# Altium project Backplane_1_8.PrjPcb
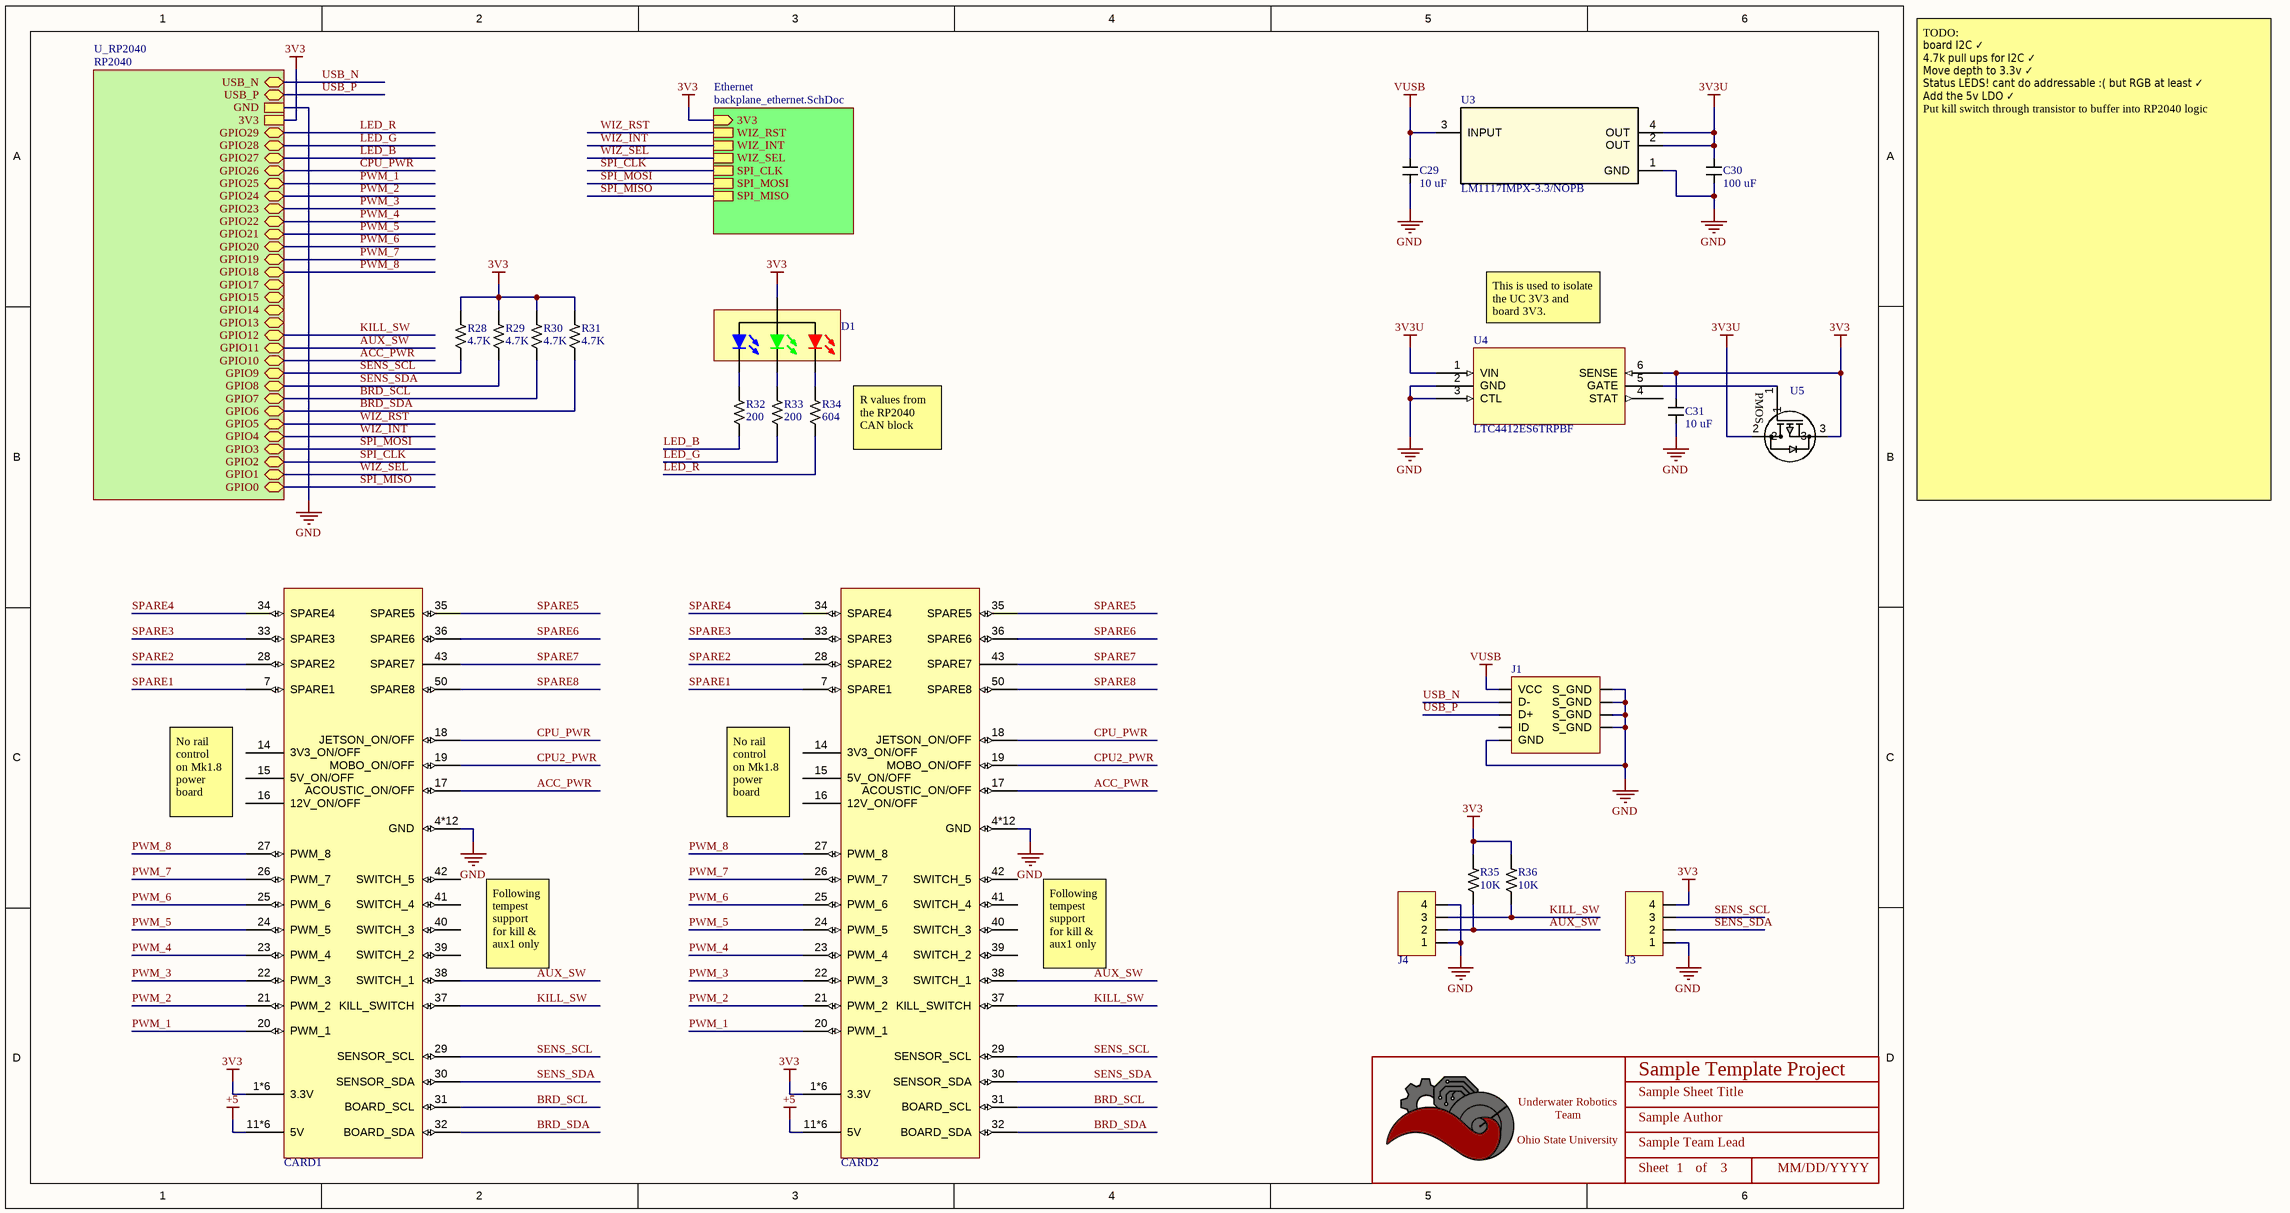
[diagram p0: backplane_main.SchDoc]
BoardRevision: 1.0; DateOfDesignReview: XX/XX/XXXX; ProjectTitle: Sample Template Project; TeamLead: Sample Team Lead
2 sheets, 60 parts. Net scope: hierarchical (ports join the sheet entries above them; power ports are global).
Board file: backplane_1_8.PcbDoc
Sheets:
  backplane_main.SchDoc
    Ethernet = backplane_ethernet.SchDoc

## Sheet backplane_main.SchDoc: Sample Sheet Title
size B; Date: MM/DD/YYYY; Author: Sample Author; Organization: ORGANIZATION; Address1: ADDRESS 1; Address2: ADDRESS 2; Address3: ADDRESS 3; Address4: ADDRESS 4; Revision: -; SheetNumber: 1; SheetTotal: 3; ENG_APP_DATE: --/--/--; DSN_APP_DATE: --/--/--; CHK_APP_DATE: --/--/--

### Parts
*  Title_Block  [LOGO]  (value not drawn)  (graphical)
C29  Value (uF): 10 uF  [CAPACITOR_0603]  (hidden comment: 10uF Ceramic 6.3V)
C30  Value (uF): 100 uF  [CAPACITOR_0603]  (hidden comment: 100uF Ceramic 6.3V)
C31  Value (uF): 10 uF  [CAPACITOR_0603]  (hidden comment: 10uF Ceramic 6.3V)
CARD1  BACKPLANE_EDGE_SOCKET  [SOCKET_BACKPLANE_EDGE_CONN]  (value not drawn)
CARD2  BACKPLANE_EDGE_SOCKET  [SOCKET_BACKPLANE_EDGE_CONN]  (value not drawn)
D1  EAST1616RGBB4  [LED_0606_4SMD]  (value not drawn)
J1  USB_MICRO R/A  [CONN_MINIUSB]  (value not drawn)
J3  4 POS R/A  [CONN_MOLEX_MINIFIT JR_4 POS_R/A]  (value not drawn)
J4  4 POS R/A  [CONN_MOLEX_MINIFIT JR_4 POS_R/A]  (value not drawn)
R28  Value  (Ohms): 4.7K  [RESISTOR_0603]  (hidden comment: 10k Ohm 5% 1/10W)
R29  Value  (Ohms): 4.7K  [RESISTOR_0603]  (hidden comment: 10k Ohm 5% 1/10W)
R30  Value  (Ohms): 4.7K  [RESISTOR_0603]  (hidden comment: 10k Ohm 5% 1/10W)
R31  Value  (Ohms): 4.7K  [RESISTOR_0603]  (hidden comment: 10k Ohm 5% 1/10W)
R32  Value  (Ohms): 200  [RESISTOR_0603]  (hidden comment: 10k Ohm 5% 1/10W)
R33  Value  (Ohms): 200  [RESISTOR_0603]  (hidden comment: 10k Ohm 5% 1/10W)
R34  Value  (Ohms): 604  [RESISTOR_0603]  (hidden comment: 10k Ohm 5% 1/10W)
R35  Value  (Ohms): 10K  [RESISTOR_0603]  (hidden comment: 10k Ohm 5% 1/10W)
R36  Value  (Ohms): 10K  [RESISTOR_0603]  (hidden comment: 10k Ohm 5% 1/10W)
U3  LM1117IMPX-3.3/NOPB  [SOT-223-4]
U4  LTC4412ES6TRPBF  [TSOT-23_S6]
U5  MOSFET P-CHANNEL 20V 4.7A SOT23  [SOT-23-3]  (value not drawn)

### Sub-sheets
Ethernet = backplane_ethernet.SchDoc: WIZ_RST, WIZ_INT, WIZ_SEL, SPI_CLK, SPI_MOSI, SPI_MISO, 3V3 (in)
U_RP2040 = RP2040 (file not in this document): GPIO0 (bidir), GPIO1 (bidir), GPIO2 (bidir), GPIO3 (bidir), GPIO4 (bidir), GPIO5 (bidir), GPIO6 (bidir), GPIO7 (bidir), GPIO8 (bidir), GPIO9 (bidir), GPIO10 (bidir), GPIO11 (bidir), GPIO12 (bidir), GPIO13 (bidir), GPIO14 (bidir), GPIO15 (bidir), GPIO17 (bidir), GPIO18 (bidir), GPIO19 (bidir), GPIO20 (bidir), GPIO21 (bidir), GPIO22 (bidir), GPIO23 (bidir), GPIO24 (bidir), GPIO25 (bidir), GPIO26 (bidir), GPIO27 (bidir), GPIO28 (bidir), GPIO29 (bidir), 3V3, GND, USB_P (bidir), USB_N (bidir)

### Nets
3V3: C31.1 CARD1.1*6(3.3V) CARD2.1*6(3.3V) D1.4 J3.4 R28.1 R29.1 R30.1 R31.1 R35.1 R36.1 U4.6(SENSE) U5.3 ; sheet U_RP2040/3V3, sheet Ethernet/3V3
3V3U: C30.1 U3.2(OUT) U3.4(OUT) U4.1(VIN) U5.2
+5: CARD1.11*6(5V) CARD2.11*6(5V)
GND: C29.2 C30.2 C31.2 CARD1.4*12(GND) CARD2.4*12(GND) J1.5(GND) J1.6(S_GND) J1.7(S_GND) J1.8(S_GND) J1.9(S_GND) J3.1 J4.1 J4.4 U3.1(GND) U4.2(GND) U4.3(CTL) ; sheet U_RP2040/GND
VUSB: C29.1 J1.1(VCC) U3.3(INPUT)
ACC_PWR: CARD1.17(ACOUSTIC_ON/OFF) CARD2.17(ACOUSTIC_ON/OFF) ; sheet U_RP2040/GPIO10
AUX_SW: CARD1.38(SWITCH_1) CARD2.38(SWITCH_1) J4.2 R35.2 ; sheet U_RP2040/GPIO11
BRD_SCL: CARD1.31(BOARD_SCL) CARD2.31(BOARD_SCL) R30.2 ; sheet U_RP2040/GPIO7
BRD_SDA: CARD1.32(BOARD_SDA) CARD2.32(BOARD_SDA) R31.2 ; sheet U_RP2040/GPIO6
CPU2_PWR: CARD1.19(MOBO_ON/OFF) CARD2.19(MOBO_ON/OFF)
CPU_PWR: CARD1.18(JETSON_ON/OFF) CARD2.18(JETSON_ON/OFF) ; sheet U_RP2040/GPIO26
KILL_SW: CARD1.37(KILL_SWITCH) CARD2.37(KILL_SWITCH) J4.3 R36.2 ; sheet U_RP2040/GPIO12
LED_B: R32.2 ; sheet U_RP2040/GPIO27
LED_G: R33.2 ; sheet U_RP2040/GPIO28
LED_R: R34.2 ; sheet U_RP2040/GPIO29
PWM_1: CARD1.20(PWM_1) CARD2.20(PWM_1) ; sheet U_RP2040/GPIO25
PWM_2: CARD1.21(PWM_2) CARD2.21(PWM_2) ; sheet U_RP2040/GPIO24
PWM_3: CARD1.22(PWM_3) CARD2.22(PWM_3) ; sheet U_RP2040/GPIO23
PWM_4: CARD1.23(PWM_4) CARD2.23(PWM_4) ; sheet U_RP2040/GPIO22
PWM_5: CARD1.24(PWM_5) CARD2.24(PWM_5) ; sheet U_RP2040/GPIO21
PWM_6: CARD1.25(PWM_6) CARD2.25(PWM_6) ; sheet U_RP2040/GPIO20
PWM_7: CARD1.26(PWM_7) CARD2.26(PWM_7) ; sheet U_RP2040/GPIO19
PWM_8: CARD1.27(PWM_8) CARD2.27(PWM_8) ; sheet U_RP2040/GPIO18
SENS_SCL: CARD1.29(SENSOR_SCL) CARD2.29(SENSOR_SCL) J3.3 R28.2 ; sheet U_RP2040/GPIO9
SENS_SDA: CARD1.30(SENSOR_SDA) CARD2.30(SENSOR_SDA) J3.2 R29.2 ; sheet U_RP2040/GPIO8
SPARE1: CARD1.7(SPARE1) CARD2.7(SPARE1)
SPARE2: CARD1.28(SPARE2) CARD2.28(SPARE2)
SPARE3: CARD1.33(SPARE3) CARD2.33(SPARE3)
SPARE4: CARD1.34(SPARE4) CARD2.34(SPARE4)
SPARE5: CARD1.35(SPARE5) CARD2.35(SPARE5)
SPARE6: CARD1.36(SPARE6) CARD2.36(SPARE6)
SPARE7: CARD1.43(SPARE7) CARD2.43(SPARE7)
SPARE8: CARD1.50(SPARE8) CARD2.50(SPARE8)
SPI_CLK: sheet U_RP2040/GPIO2, sheet Ethernet/SPI_CLK
SPI_MISO: sheet U_RP2040/GPIO0, sheet Ethernet/SPI_MISO
SPI_MOSI: sheet U_RP2040/GPIO3, sheet Ethernet/SPI_MOSI
USB_N: J1.2(D-) ; sheet U_RP2040/USB_N
USB_P: J1.3(D+) ; sheet U_RP2040/USB_P
WIZ_INT: sheet U_RP2040/GPIO4, sheet Ethernet/WIZ_INT
WIZ_RST: sheet U_RP2040/GPIO5, sheet Ethernet/WIZ_RST
WIZ_SEL: sheet U_RP2040/GPIO1, sheet Ethernet/WIZ_SEL
NetD1_1: D1.1 R34.1
NetD1_2: D1.2 R33.1
NetD1_3: D1.3 R32.1
NetU4_5: U4.5(GATE) U5.1

Not connected (* = marked no-connect by the designer): CARD1 14(3V3_ON/OFF) 15(5V_ON/OFF) 16(12V_ON/OFF) 39(SWITCH_2) 40(SWITCH_3) 41(SWITCH_4) 42(SWITCH_5); CARD2 14(3V3_ON/OFF) 15(5V_ON/OFF) 16(12V_ON/OFF) 39(SWITCH_2) 40(SWITCH_3) 41(SWITCH_4) 42(SWITCH_5); J1 4(ID); U4 4(STAT)

### Notes on the sheet
- This is used to isolate the UC 3V3 and board 3V3.
- R values from the RP2040 CAN block
- TODO:
  board I2C ✓
  4.7k pull ups for I2C ✓
  Move depth to 3.3v ✓
  Status LEDS! cant do addressable :( but RGB at least ✓
  Add the 5v LDO ✓
  Put kill switch through transistor to buffer into RP2040 logic
- No rail control
  on Mk1.8 power board
- Following tempest support for kill & aux1 only
- DWG. NO.
- REV.
- SHT.
- THIS DOCUMENT AND THE DATA DISCLOSED HEREIN OR HEREWITH IS THE PROPERTY OF ALTIUM LIMITED AND MAY BE FREELY DISTRIBUTED IN WHOLE. NO RIGHTS ARE RESERVED OR EXPRESS OR IMPLIED WARANTEE GIVEN.
- REVISION
- DESCRIPTION
- DATE
- APPROVED
- ENG:
- APPROVALS
- PROJECT
- DSN:
- CHK:
- REFERENCE DOCUMENTS
- PROJECT REVISION:
- TITLE
- DOCUMENT REVISION:
- DESIGN ITEM:
- BOM:
- FAB DWG:
- PCB DWG:
- ASSY DWG:
- SCALE:
- SIZE
- B
- CAGE CODE
- FILE NAME
- DWG NO.
- SHEET
- OF
- REV
- (in symbol Title_Block) Underwater Robotics Team / Ohio State University; Sheet; of
- (in symbol TSM500P02CX) PMOS

### Library data of the parts
* = Title_Block: UWRT Schematic Title Block Template / Created June 2021, Dylan Trainor
C29 C31 = CAPACITOR_10uF_0603: Cap 10uF 6.3V +/-20% / Ceramic 0603; Made By: Flip B; ComponentLink1Description: Digikey; ComponentLink1URL: https://www.digikey.com/en/products/detail/samsung-electro-mechanics/CL10A106MQ8NNNC/3886777; Supplier 1: Digi-Key; Supplier Part Number 1: 1276-1119-1-ND; Tolerance: +/- 20%; Voltage: 6.3V
C30 = CAPACITOR_100uF_0603: Cap 100uF 6.3V +/-20% / Ceramic 0603; Made By: Dylan Trainor; ComponentLink1Description: Digikey; ComponentLink1URL: https://www.digikey.com/en/products/detail/samsung-electro-mechanics/CL10A106MQ8NNNC/3886777; Tolerance: +/- 20%; Voltage: 6.3V; Supplier 1: RSComponents; Supplier Part Number 1: 6911206
CARD1 CARD2 = BACKPLANE_EDGE_SOCKET: Backplane Edge Socket; pin to pad: 1*6>1+2+3+54+55+56 4*12>4+5+6+8+9+10+47+48+49+51+52+53 11*6>11+12+13+44+45+46; Made By: Robert Pafford; Supplier 1: Digi-Key; Supplier Part Number 1: A31719-ND
D1 = LED_RGB_4SMD: LED RGB CLEAR 4SMD; Made By: Robert Pafford; Red Forward Voltage: 1.8V; Red Forward Current: 5mA; Green Forward Voltage: 2.8V; ComponentLink1Description: Datasheet; ComponentLink1URL: https://everlightamericas.com/index.php?controller=attachment&id_attachment=3220; Package: 4-SMD; Green Forward Current: 5mA; Blue Forward Voltage: 2.8V; Blue Forward Current: 5mA; Color: RGB; Supplier 1: Digi-Key; Supplier Part Number 1: 1080-1552-1-ND
J1 = CONN_MICROUSB: Amphenol Micro USB-B / USB2.0 5 Pin Right Angle SMD; Pitch: 0.65mm; Current Per Pin: 1.8A; Number of Positions: 5; Manufacturer: Amphenol; Configuration: Right Angle; Color: Silver; Created By: Flip B; ComponentLink1Description: Datasheet; ComponentLink1URL: https://cdn.amphenol-icc.com/media/wysiwyg/files/documentation/datasheet/inputoutput/io_usb_micro.pdf?__cf_chl_jschl_tk__=05693735e19256298f6ef6ca2bb2e65c376a4f56-1625503833-0-Abitsb0-ufjOXJYs_S3J3r2iTn-nObalbmXUksF1VvO_h_WEmRdMlUD1I8-hmWSEVWzY1pirKnrPZWfgY3851qyBZe5ZvnNQePLGIzUgdEIQBVUyW36RsbYpDLEWxJ4horD-5gChFgobLYqwmG5aHl0E8lIn_twwPPrOxilK2gP0q9t_CNOs_u5fMqXvXUrlsOv8tIE2NRlu6NVP8qtkL2GjhlkeTUbDMF8WvvpPDTFOgvZ4Y16Ej8F8AhWos88mo5B1HssXozw0XrkJQIqERITUu6rqloz9kf4ZzhBHtDAt-IkiAFY_Ds9SW8FYKKTtINJVpHZQ6Gyu1FFM4Dc9MO0maE8_mmNcwlxqyRoRk_MPWW8VyByXWM5RSp52jteRKw7FeI9WIYvCbPAOy0Eyib-aseIQsnGbglBcUY6_2xp8GYaJM38H3dNvBPsSOfJBPndKedwKHllxjkucXn6xsN0sDXkpGN-cu8_2bDTJ0g-uUucKSCooYX-ApSDNGpkA_p9zv1SOAD8c0zaZVmtiBsN75QpVz2rzq9_BFxOywPvR; Series: 10118192; Supplier 1: Digi-Key; Supplier Part Number 1: 609-4613-1-ND
J3 J4 = CONN_MOLEX_MINIFIT JR_4POS_R/A: Molex Minifit Jr. 5569 / 4 Pos R/A Natural; Pitch: 4.2mm; Configuration: Right Angle; Current Per Pin: 13A; Number of Positions: 4; Supplier Part Number 1: WM13112-ND; Supplier 1: Digi-Key; Manufacturer: Molex; Color: Natural; Created By: Flip B; ComponentLink1Description: Datasheet; ComponentLink1URL: https://www.molex.com/pdm_docs/sd/026013115_sd.pdf; Series: Minifit Jr 5569
R28-R36 = RESISTOR_10K_0603: RES 10k OHM 5% 1/10W 0603; Tolerance: +/- 5%; Wattage: 1/8W; Made By: Robert Pafford; ComponentLink1Description: Datasheet; ComponentLink1URL: https://www.bourns.com/docs/product-datasheets/CRxxxxx.pdf; Supplier: Digikey; Digikey Part Numer: CR0603-JW-104ELFTR-ND; Supplier 1: Digi-Key; Supplier Part Number 1: 2019-RK73B1JTTD103JCT-ND
U3 = LM1117IMPX-3.3/NOPB: IC REG LIN 3.3V 800MA SOT223-4; PartNumber: LM1117IMP-3.3/NOPB; Manufacturer: Texas Instruments; Vin (Max): 15V; Supplier 1: Digi-Key; Supplier Part Number 1: LM1117IMPX-3.3/NOPBCT-ND; Vout (Min/Fixed): 3.3V; Amp Out: 800mA; Package: SOT-223-4; Created By: Dylan T
U4 = LTC4412ES6TRPBF: OR Controller Source Selector Switch P-Channel 2:1 TSOT-23-6; MP: LTC4412ES6#TRPBF; MF: Analog Devices; Price: None; Availability: Good; Mouser-Purchase-URL: https://snapeda.com/shop?store=Mouser&id=4343773; Arrow_Europe-Purchase-URL: https://snapeda.com/shop?store=Arrow+Europe&id=4343773; DigiKey-Purchase-URL: https://snapeda.com/shop?store=DigiKey&id=4343773; Package: SOT-23-6 Analog Devices; SnapEDA_Link: https://www.snapeda.com/parts/LTC4412ES6%23TRPBF/Analog%20Devices/view-part/4343773/?ref=snap; Value: *; Check_prices: https://www.snapeda.com/parts/LTC4412ES6%23TRPBF/Analog%20Devices/view-part/4343773/?ref=eda
U5 = TSM500P02CX: P-Channel 20 V 4.7A (Tc) 1.56W (Tc) Surface Mount SOT-23; Vendor: Taiwan Semiconductor Corporation; Vgs (Max): ±10V; Vgs (th): 800mV @ 250µA; Rds (on): 50mOhm @ 3A, 4.5V; Amp Rating: 4.7 A; FET Type: P-Channel; Package: TO-236-3, SC-59, SOT-23-3; Manufacturer_Part_Number: TSM500P02CX; Vdss: 20 V; Power Dissipation: 1.56W (Tc); Created By: Robert Pafford; Supplier 1: Digi-Key; Supplier Part Number 1: TSM500P02CXRFGCT-ND

## Sheet backplane_ethernet.SchDoc
size A; SheetNumber: 2; SheetTotal: 3
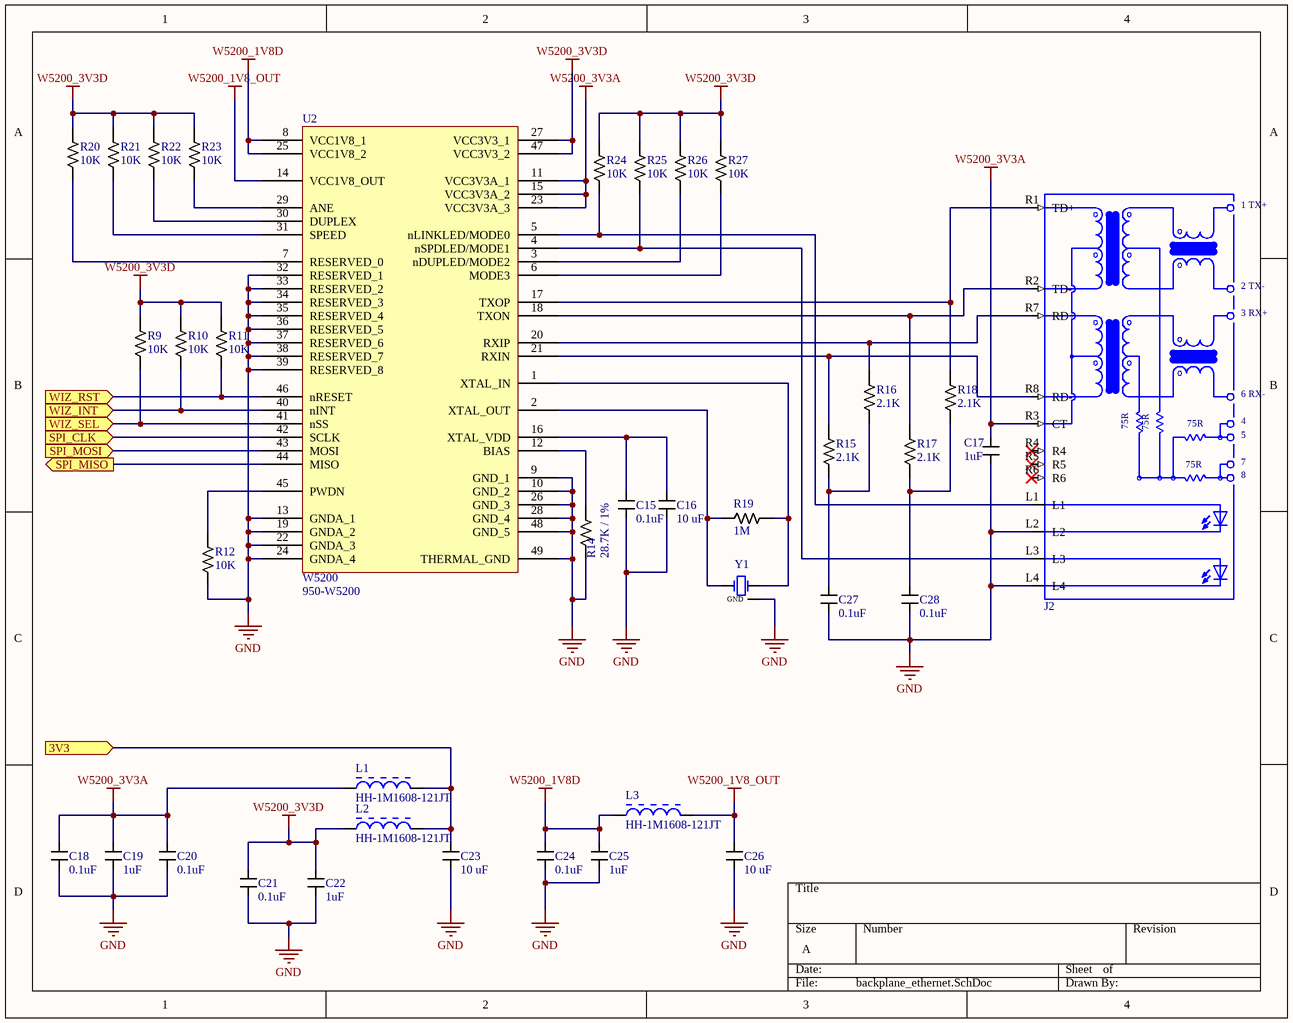
[diagram p1: backplane_ethernet.SchDoc]

### Parts
C15  value 0.1uF  [CAPACITOR_0603]  (hidden comment: 100nF Ceramic 6.3V)
C16  Value (uF): 10 uF  [CAPACITOR_0603]  (hidden comment: 10uF Ceramic 6.3V)
C17  value 1uF  [CAPACITOR_0603]  (hidden comment: 1uF Ceramic 16V)
C18  value 0.1uF  [CAPACITOR_0603]  (hidden comment: 100nF Ceramic 6.3V)
C19  value 1uF  [CAPACITOR_0603]  (hidden comment: 1uF Ceramic 16V)
C20  value 0.1uF  [CAPACITOR_0603]  (hidden comment: 100nF Ceramic 6.3V)
C21  value 0.1uF  [CAPACITOR_0603]  (hidden comment: 100nF Ceramic 6.3V)
C22  value 1uF  [CAPACITOR_0603]  (hidden comment: 1uF Ceramic 16V)
C23  Value (uF): 10 uF  [CAPACITOR_0603]  (hidden comment: 10uF Ceramic 6.3V)
C24  value 0.1uF  [CAPACITOR_0603]  (hidden comment: 100nF Ceramic 6.3V)
C25  value 1uF  [CAPACITOR_0603]  (hidden comment: 1uF Ceramic 16V)
C26  Value (uF): 10 uF  [CAPACITOR_0603]  (hidden comment: 10uF Ceramic 6.3V)
C27  value 0.1uF  [CAPACITOR_0603]  (hidden comment: 100nF Ceramic 6.3V)
C28  value 0.1uF  [CAPACITOR_0603]  (hidden comment: 100nF Ceramic 6.3V)
J2  Ethernet Connector  [WIZNET_RB1-125BAG1A]  (value not drawn)
L1  HH-1M1608-121JT  [CTC-1608_L]
L2  HH-1M1608-121JT  [CTC-1608_L]
L3  HH-1M1608-121JT  [CTC-1608_L]
R9  Value  (Ohms): 10K  [RESISTOR_0603]  (hidden comment: 10k Ohm 5% 1/10W)
R10  Value  (Ohms): 10K  [RESISTOR_0603]  (hidden comment: 10k Ohm 5% 1/10W)
R11  Value  (Ohms): 10K  [RESISTOR_0603]  (hidden comment: 10k Ohm 5% 1/10W)
R12  Value  (Ohms): 10K  [RESISTOR_0603]  (hidden comment: 10k Ohm 5% 1/10W)
R14  Value  (Ohms): 28.7K / 1%  [RESISTOR_0603]  (hidden comment: K / 1%)
R15  Value  (Ohms): 2.1K  [RESISTOR_0603]  (hidden comment: 2.1k Ohm 5% 1/8W)
R16  Value  (Ohms): 2.1K  [RESISTOR_0603]  (hidden comment: 2.1k Ohm 5% 1/8W)
R17  Value  (Ohms): 2.1K  [RESISTOR_0603]  (hidden comment: 2.1k Ohm 5% 1/8W)
R18  Value  (Ohms): 2.1K  [RESISTOR_0603]  (hidden comment: 2.1k Ohm 5% 1/8W)
R19  1M  [RESISTOR_0603]
R20  Value  (Ohms): 10K  [RESISTOR_0603]  (hidden comment: 10k Ohm 5% 1/10W)
R21  Value  (Ohms): 10K  [RESISTOR_0603]  (hidden comment: 10k Ohm 5% 1/10W)
R22  Value  (Ohms): 10K  [RESISTOR_0603]  (hidden comment: 10k Ohm 5% 1/10W)
R23  Value  (Ohms): 10K  [RESISTOR_0603]  (hidden comment: 10k Ohm 5% 1/10W)
R24  Value  (Ohms): 10K  [RESISTOR_0603]  (hidden comment: 10k Ohm 5% 1/10W)
R25  Value  (Ohms): 10K  [RESISTOR_0603]  (hidden comment: 10k Ohm 5% 1/10W)
R26  Value  (Ohms): 10K  [RESISTOR_0603]  (hidden comment: 10k Ohm 5% 1/10W)
R27  Value  (Ohms): 10K  [RESISTOR_0603]  (hidden comment: 10k Ohm 5% 1/10W)
U2  W5200  Supplier Part Number 1: 950-W5200  [QFN-48]
Y1  CRYSTAL 25.0000MHZ 18PF SMD  [4-SMD No Lead Crystal]  (value not drawn)

### Ports
3V3 (in), SPI_CLK (in), SPI_MISO (out), SPI_MOSI (in), WIZ_INT (in), WIZ_RST (in), WIZ_SEL (in)

### Nets
3V3: C23.1 L1.2 L2.2 ; port 3V3
GND: C15.2 C16.2 C17.2 C18.2 C19.2 C20.2 C21.2 C22.2 C23.2 C24.2 C25.2 C26.2 C27.2 C28.2 J2.L2 J2.L4 R12.2 R14.2 U2.9(GND_1) U2.10(GND_2) U2.13(GNDA_1) U2.19(GNDA_2) U2.22(GNDA_3) U2.24(GNDA_4) U2.26(GND_3) U2.28(GND_4) U2.32(RESERVED_1) U2.33(RESERVED_2) U2.34(RESERVED_3) U2.35(RESERVED_4) U2.36(RESERVED_5) U2.37(RESERVED_6) U2.38(RESERVED_7) U2.39(RESERVED_8) U2.48(GND_5) U2.49(THERMAL_GND) Y1.GND
W5200_1V8_OUT: C26.1 L3.2 U2.14(VCC1V8_OUT)
W5200_1V8D: C24.1 C25.1 L3.1 U2.8(VCC1V8_1) U2.25(VCC1V8_2)
W5200_3V3A: C17.1 C18.1 C19.1 C20.1 J2.R3(CT) L1.1 U2.11(VCC3V3A_1) U2.15(VCC3V3A_2) U2.23(VCC3V3A_3)
W5200_3V3D: C21.1 C22.1 L2.1 R9.1 R10.1 R11.1 R20.1 R21.1 R22.1 R23.1 R24.1 R25.1 R26.1 R27.1 U2.27(VCC3V3_1) U2.47(VCC3V3_2)
SPI_CLK: U2.42(SCLK) ; port SPI_CLK
SPI_MISO: U2.44(MISO) ; port SPI_MISO
SPI_MOSI: U2.43(MOSI) ; port SPI_MOSI
WIZ_INT: R10.2 U2.40(nINT) ; port WIZ_INT
WIZ_RST: R11.2 U2.46(nRESET) ; port WIZ_RST
WIZ_SEL: R9.2 U2.41(nSS) ; port WIZ_SEL
NetC15_1: C15.1 C16.1 U2.16(XTAL_VDD)
NetC27_1: C27.1 R15.2 R16.2
NetC28_1: C28.1 R17.2 R18.2
NetJ2_L1: J2.L1 R24.2 U2.5(nLINKLED/MODE0)
NetJ2_L3: J2.L3 R25.2 U2.4(nSPDLED/MODE1)
NetJ2_R1: J2.R1(TD+) R18.1 U2.17(TXOP)
NetJ2_R2: J2.R2(TD-) R17.1 U2.18(TXON)
NetJ2_R7: J2.R7(RD+) R16.1 U2.20(RXIP)
NetJ2_R8: J2.R8(RD-) R15.1 U2.21(RXIN)
NetR12_1: R12.1 U2.45(PWDN)
NetR14_1: R14.1 U2.12(BIAS)
NetR19_1: R19.1 U2.1(XTAL_IN) Y1.2
NetR19_2: R19.2 U2.2(XTAL_OUT) Y1.1
NetR20_2: R20.2 U2.7(RESERVED_0)
NetR21_2: R21.2 U2.31(SPEED)
NetR22_2: R22.2 U2.30(DUPLEX)
NetR23_2: R23.2 U2.29(ANE)
NetR26_2: R26.2 U2.3(nDUPLED/MODE2)
NetR27_2: R27.2 U2.6(MODE3)

Not connected (* = marked no-connect by the designer): J2 R4* R5* R6*

### Notes on the sheet
- (in symbol RB1-125BAG1A) 1 TX+; 2 TX-; 3 RX+; 6 RX-; 75R; 4; 5; 7; 8

### Library data of the parts
C15 C18 C20 C21 C24 C27 C28 = CAPACITOR_0.1uF_0603: Cap 100nF 6.3V +/-10% / Ceramic 0603; Made By: Flip B; ComponentLink1Description: Datsheet; ComponentLink1URL: https://www.mouser.com/datasheet/2/212/KEM_C1002_X7R_SMD-1102033.pdf; Tolerance: +/- 10%; Voltage: 6.3V; Supplier 1: Digi-Key; Supplier Part Number 1: 399-15351-1-ND
C16 C23 C26 = CAPACITOR_10uF_0603: as C29 on sheet backplane_main; ComponentLink1Description: Digikey; ComponentLink1URL: https://www.digikey.com/en/products/detail/samsung-electro-mechanics/CL10A106MQ8NNNC/3886777; Supplier 1: Digi-Key; Supplier Part Number 1: 1276-1119-1-ND; Tolerance: +/- 20%; Voltage: 6.3V
C17 C19 C22 C25 = CAPACITOR_1uF_0603: Cap 1uF 16V +/-10% / Ceramic 0603; Made By: Flip B; Tolerance: +/- 10%; Voltage: 16V; Supplier 1: Digi-Key; Supplier Part Number 1: 399-7847-1-ND
J2 = RB1-125BAG1A: CONN JACK 1PORT 100 BASE-T PCB
L1-L3 = CMP-2000-06403-1: Chip Ferrite Bead, 0.14 Ohm, 1.1 A, -55 to 125 degC, 2-Pin SMD, RoHS, Tape and Reel; Manufacturer: CTC Coils; DC Resistance Max: 140MOhm; DC Current Max: 1.1A; Datasheet Version: 07/2004; Datasheet URL: http://data.icbank.com/ICBShop/board/beadhbm.pdf; PartNumber: HH-1M1608; Package Reference: 1608; Temperature Min: -55degC; Manufacturer URL: http://www.brokerforum.com/components-parts/CTCCoils-e-en.jsa; Mounting Technology: SurfaceMount; Temperature Max: 125degC; Package Description: 2-Pin Surface Mount Device, Body 1.6 x 0.8 mm; Packing: TapeandReel
R9-R12 R20-R27 = RESISTOR_10K_0603: as R28 on sheet backplane_main; ComponentLink1Description: Datasheet; ComponentLink1URL: https://www.bourns.com/docs/product-datasheets/CRxxxxx.pdf; Supplier: Digikey; Digikey Part Numer: CR0603-JW-104ELFTR-ND; Supplier 1: Digi-Key; Supplier Part Number 1: 2019-RK73B1JTTD103JCT-ND
R14 = RESISTOR_28.7K / 1%_0603_1: RES 28.7K OHM 1% 1/8W 0603; Tolerance: +/- 5%; Made By: Robert Pafford; ComponentLink1Description: Datasheet; ComponentLink1URL: https://www.bourns.com/docs/product-datasheets/CRxxxxx.pdf; Wattage: 1/8W; Supplier: Digikey; Digikey Part Numer: CR0603-JW-104ELFTR-ND; Supplier 1: Digi-Key; Supplier Part Number 1: 541-28.7KHCT-ND
R15-R18 = RESISTOR_2.1K_0603_1: RES 2.1k OHM 5% 1/8W 0603; Tolerance: +/- 5%; Made By: Robert Pafford; ComponentLink1Description: Datasheet; ComponentLink1URL: https://www.bourns.com/docs/product-datasheets/CRxxxxx.pdf; Wattage: 1/8W; Supplier: Digikey; Digikey Part Numer: CR0603-JW-104ELFTR-ND; Supplier 1: Digi-Key; Supplier Part Number 1: YAG1852CT-ND
R19 = RESISTOR_1M_0603_1: RES 1M OHM 1/8W 0603; Tolerance: +/- 5%; Made By: Robert Pafford; ComponentLink1Description: Datasheet; ComponentLink1URL: https://www.bourns.com/docs/product-datasheets/CRxxxxx.pdf; Wattage: 1/8W; Supplier: Digikey; Digikey Part Numer: CR0603-JW-104ELFTR-ND; Supplier 1: Digi-Key; Supplier Part Number 1: RMCF0603JT1M00CT-ND; Value  (Ohms): 1M
U2 = W5200: WIZNET W5200 / 48QFN (7x7 mm); MF: Texas Instruments; MP: LM1117IMPX-3.3/NOPB; Created by:: Siddharth.V; Texas_Instruments-Purchase-URL: https://snapeda.com/shop?store=Texas+Instruments&id=410186; Price: None; Mouser-Purchase-URL: https://snapeda.com/shop?store=Mouser&id=410186; Value: *; Availability: Good; Package: SOT-223-4 Texas Instruments; Arrow_Electronics-Purchase-URL: https://snapeda.com/shop?store=Arrow+Electronics&id=410186; SnapEDA_Link: https://www.snapeda.com/parts/LM1117IMPX-3.3/NOPB/Texas%20Instruments/view-part/410186/?ref=snap; DigiKey-Purchase-URL: https://snapeda.com/shop?store=DigiKey&id=410186; ComponentLink1Description: Datasheet; ComponentLink1URL: https://www.wiznet.io/product-item/w5200/; Supplier 1: Mouser
Y1 = CRYSTAL_25MHz_SMD_1: 25 MHz ±20ppm Crystal 18pF; pin to pad: 2>3 GND>2+4; Made By: Robert Pafford; Frequency: 12 MHz; ESR: 50 Ohmz; Load Capacitance: 18pF; Supplier 1: Digi-Key; Supplier Part Number 1: 2151-AS-25.000-18-F-EXT-ND

## Nets that join several sheets
3V3: backplane_main (13 pins), backplane_ethernet (C23.1 L1.2 L2.2)
GND: backplane_main (16 pins), backplane_ethernet (37 pins)